# Altium schematic sheet Schematic_Design.SchDoc
size B; SheetNumber: 1; SheetTotal: 1
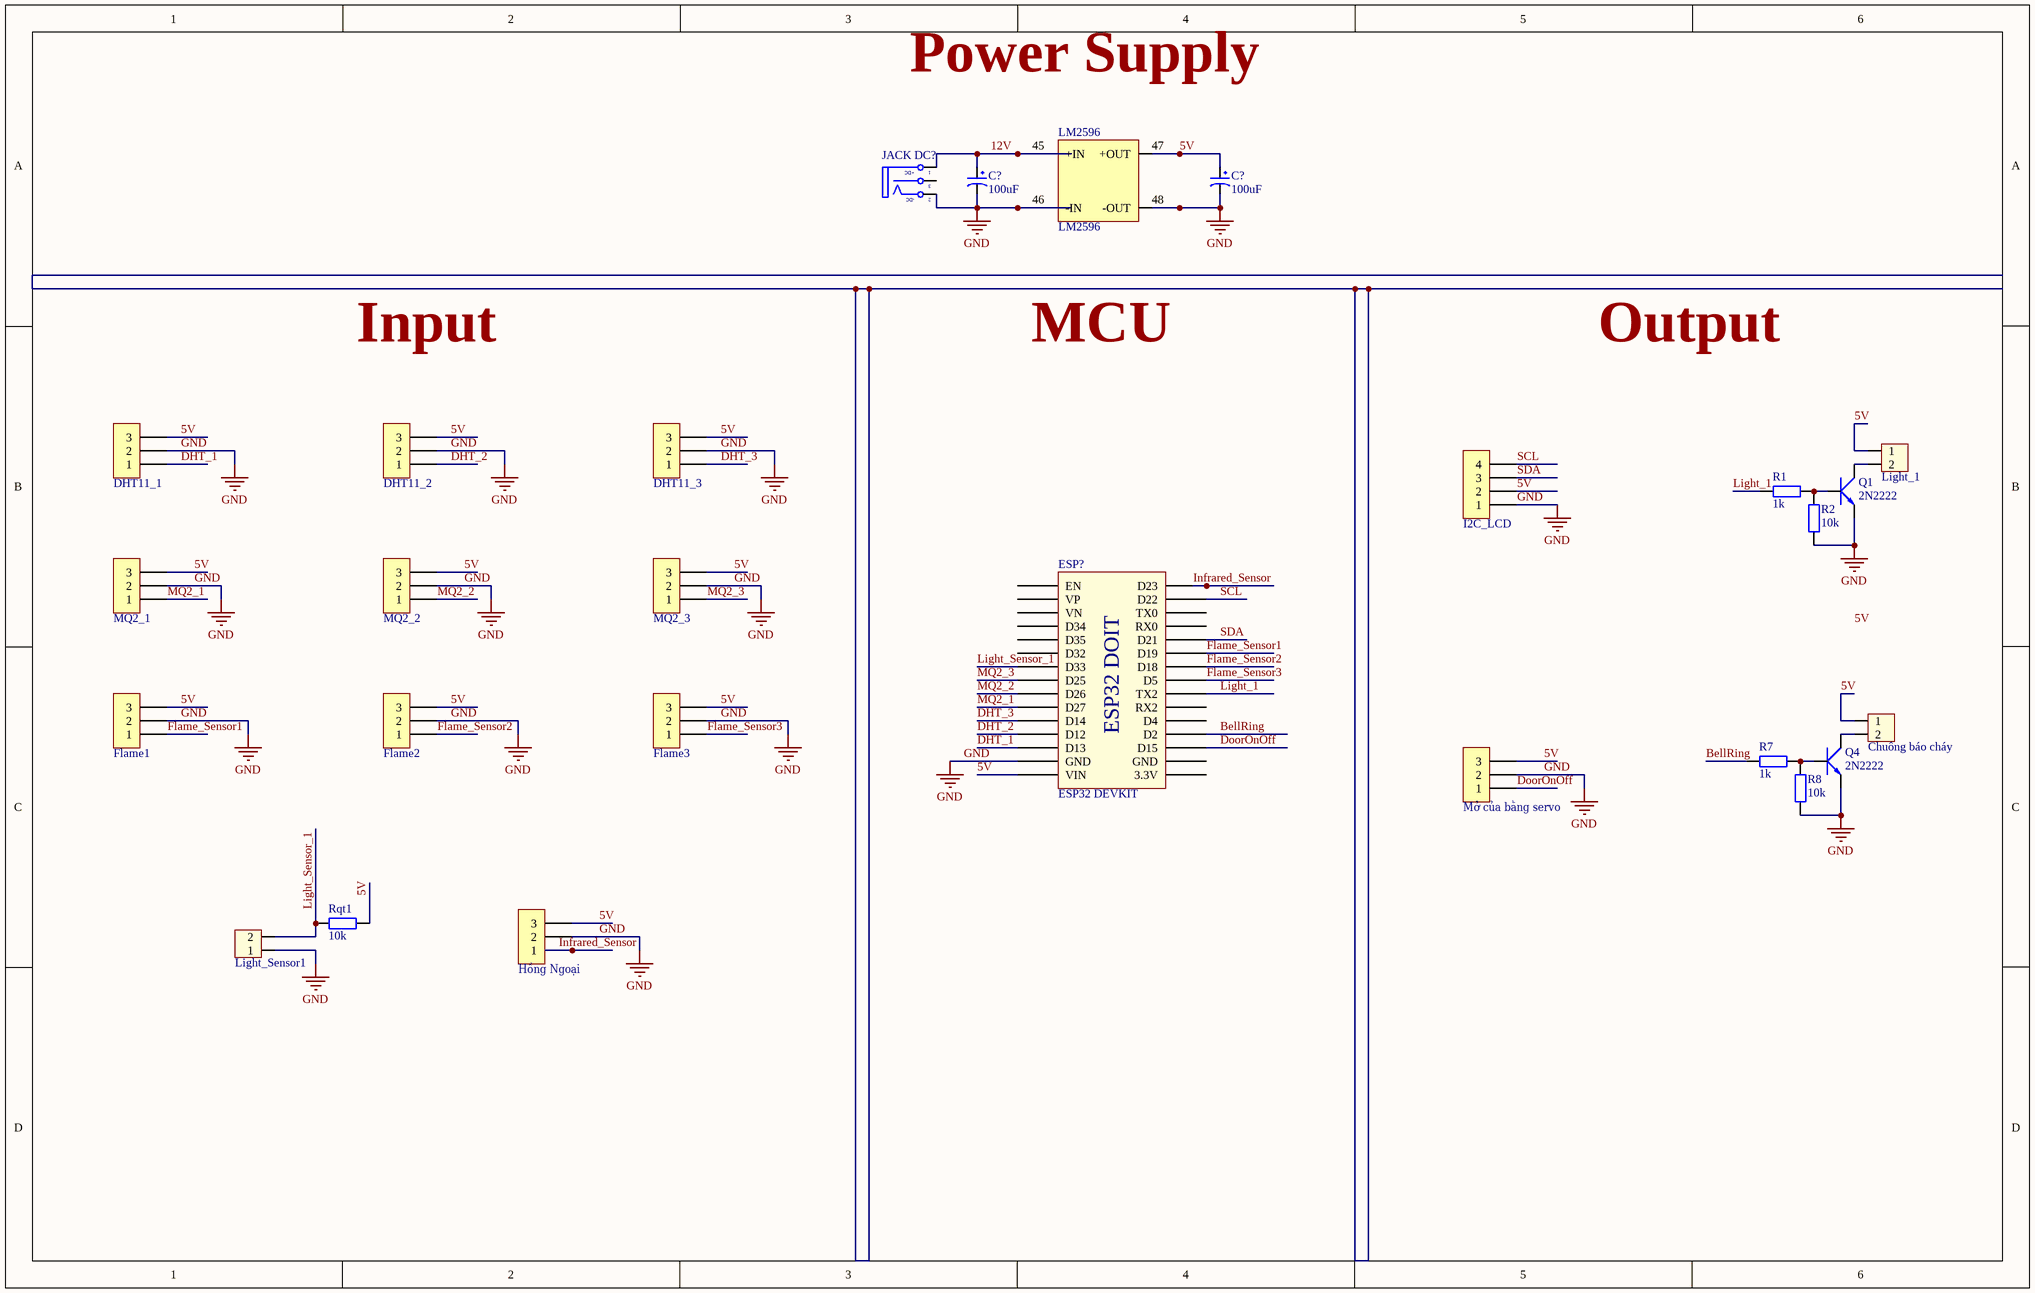
[diagram p0: Schematic_Design.SchDoc]

## Parts
(Parts that share a designator on the sheet are numbered #1, #2 ... from top to bottom, then left to right.)
C?#1  100uF  [tu hoa 5mm]
C?#2  100uF  [tu hoa 5mm]
ESP?  ESP32 DEVKIT  [ESP32 WROOM 32 KIT]
Fl1  Flame1  [XH2.54M-3]
Fl2  Flame2  [XH2.54M-3]
FL3  Flame3  [XH2.54M-3]
H111  DHT11_1  [XH2.54M-3]
H112  DHT11_2  [XH2.54M-3]
H113  DHT11_3  [XH2.54M-3]
HBR  Chuông báo cháy  [XH2.54M-2]
HI2C  I2C_LCD  [XH2.54M-4]
HIR  Hồng Ngoại  [XH2.54M-3]
HLL1  Light_1  [XH2.54M-2]
HQ1  MQ2_1  [XH2.54M-3]
HQ2  MQ2_2  [XH2.54M-3]
HQ3  MQ2_3  [XH2.54M-3]
HSV  Mở của bằng servo  [XH2.54M-3]
JACK_DC?  (no value)  [JACK DC 5.5]
LM2596  LM2596  [PCBComponent_1]
LS1  Light_Sensor1  [XH2.54M-2]
Q1  2N2222  [TO92]
Q4  2N2222  [TO92]
R1  1k  [tro vach 1/4w]
R2  10k  [tro vach 1/4w]
R7  1k  [tro vach 1/4w]
R8  10k  [tro vach 1/4w]
Rqt1  10k  [tro vach 1/4w]

## Nets
GND: C?#1.2 C?#2.2 ESP?.14(GND) Fl1.2 Fl2.2 FL3.2 H111.2 H112.2 H113.2 HI2C.1 HIR.2 HQ1.2 HQ2.2 HQ3.2 HSV.2 JACK_DC?.2(TN) LM2596.46(-IN) LM2596.48(-OUT) LS1.1 Q1.1(E) Q4.1(E) R2.1 R8.1
5V: C?#2.1 ESP?.15(VIN) Fl1.3 Fl2.3 FL3.3 H111.3 H112.3 H113.3 HBR.1 HI2C.2 HIR.3 HLL1.1 HQ1.3 HQ2.3 HQ3.3 HSV.3 LM2596.47(+OUT) Rqt1.2
12V: C?#1.1 JACK_DC?.1(T) LM2596.45(+IN)
BellRing: ESP?.19(D2) R7.1
DHT_1: ESP?.13(D13) H111.1
DHT_2: ESP?.12(D12) H112.1
DHT_3: ESP?.11(D14) H113.1
DoorOnOff: ESP?.18(D15) HSV.1
Flame_Sensor1: ESP?.25(D19) Fl1.1
Flame_Sensor2: ESP?.24(D18) Fl2.1
Flame_Sensor3: ESP?.23(D5) FL3.1
Infrared_Sensor: ESP?.30(D23) HIR.1
Light_1: ESP?.22(TX2) R1.1
Light_Sensor_1: ESP?.7(D33) LS1.2 Rqt1.1
MQ2_1: ESP?.10(D27) HQ1.1
MQ2_2: ESP?.9(D26) HQ2.1
MQ2_3: ESP?.8(D25) HQ3.1
SCL: ESP?.29(D22) HI2C.4
SDA: ESP?.26(D21) HI2C.3
NetHBR_2: HBR.2 Q4.2(C)
NetHLL1_2: HLL1.2 Q1.2(C)
NetQ1_3: Q1.3(B) R1.2 R2.2
NetQ4_3: Q4.3(B) R7.2 R8.2

Not connected (* = marked no-connect by the designer): ESP? 1(EN) 2(VP) 3(VN) 4(D34) 5(D35) 6(D32) 16(3.3V) 17(GND) 20(D4) 21(RX2) 27(RX0) 28(TX0); JACK_DC? 3(S)

## Notes on the sheet
- Labels drawn without touching a wire or pin: 5V, Input, MCU, Output, Power Supply
- (in symbol ESP32 WROOM 32 KIT) ESP32 DOIT
- (in symbol JACK DC 5.5) +DC; -DC

## Library data of the parts
C?#1 C?#2 = Tu Hoa 100uF 16V 5x11: Cắm; Don_Vi: Con; So_Chan: 2; Ten_Linh_Kien: Tụ Hóa 100uF 16V 5x11MM; Ma_Hang: MH008417; Chung_Loai: Cắm; Kieu_Chan: *
ESP? = ESP32 WROOM 32 KIT
Fl1 Fl2 FL3 H111-H113 HIR HQ1-HQ3 HSV = Header 3P 2.54 Duc Thang: Cắm; Ten_Linh_Kien: Header 3P XH2.54-3P Đực Thẳng; Don_Vi: Con; Ma_Hang: MH001292; Chung_Loai: Cắm
HBR HLL1 LS1 = Header 2P 2.54 Duc Thang: Cắm; Ten_Linh_Kien: Header 2P XH2.54-2P Đực Thẳng; Don_Vi: Con; Ma_Hang: MH001283; Chung_Loai: Cắm
HI2C = Header 4P 2.54 Duc Thang: Cắm; Ten_Linh_Kien: Header 4P XH2.54-4P Đực Thẳng; Don_Vi: Con; Ma_Hang: MH001285; Chung_Loai: Cắm
JACK_DC? = JACK DC 5.5: Value: Jac DC
LM2596 = xl4015
Q1 Q4 = Trans C1815 DIP: NPN transistor; Value: C9014
R1 R2 R7 R8 Rqt1 = Tro Vach 1/4W 5% 180R: Cắm; Don_Vi: Con; Ten_Linh_Kien: Trở Vạch 1/4w 5% 180R; Ma_Hang: MH007290; So_Chan: 2; Chung_Loai: Cắm; Kieu_Chan: *